# Altium schematic sheet [01] - COVER PAGE.SchDoc
size A3; DocumentNumber: 1; SheetNumber: 1; SheetTotal: 32
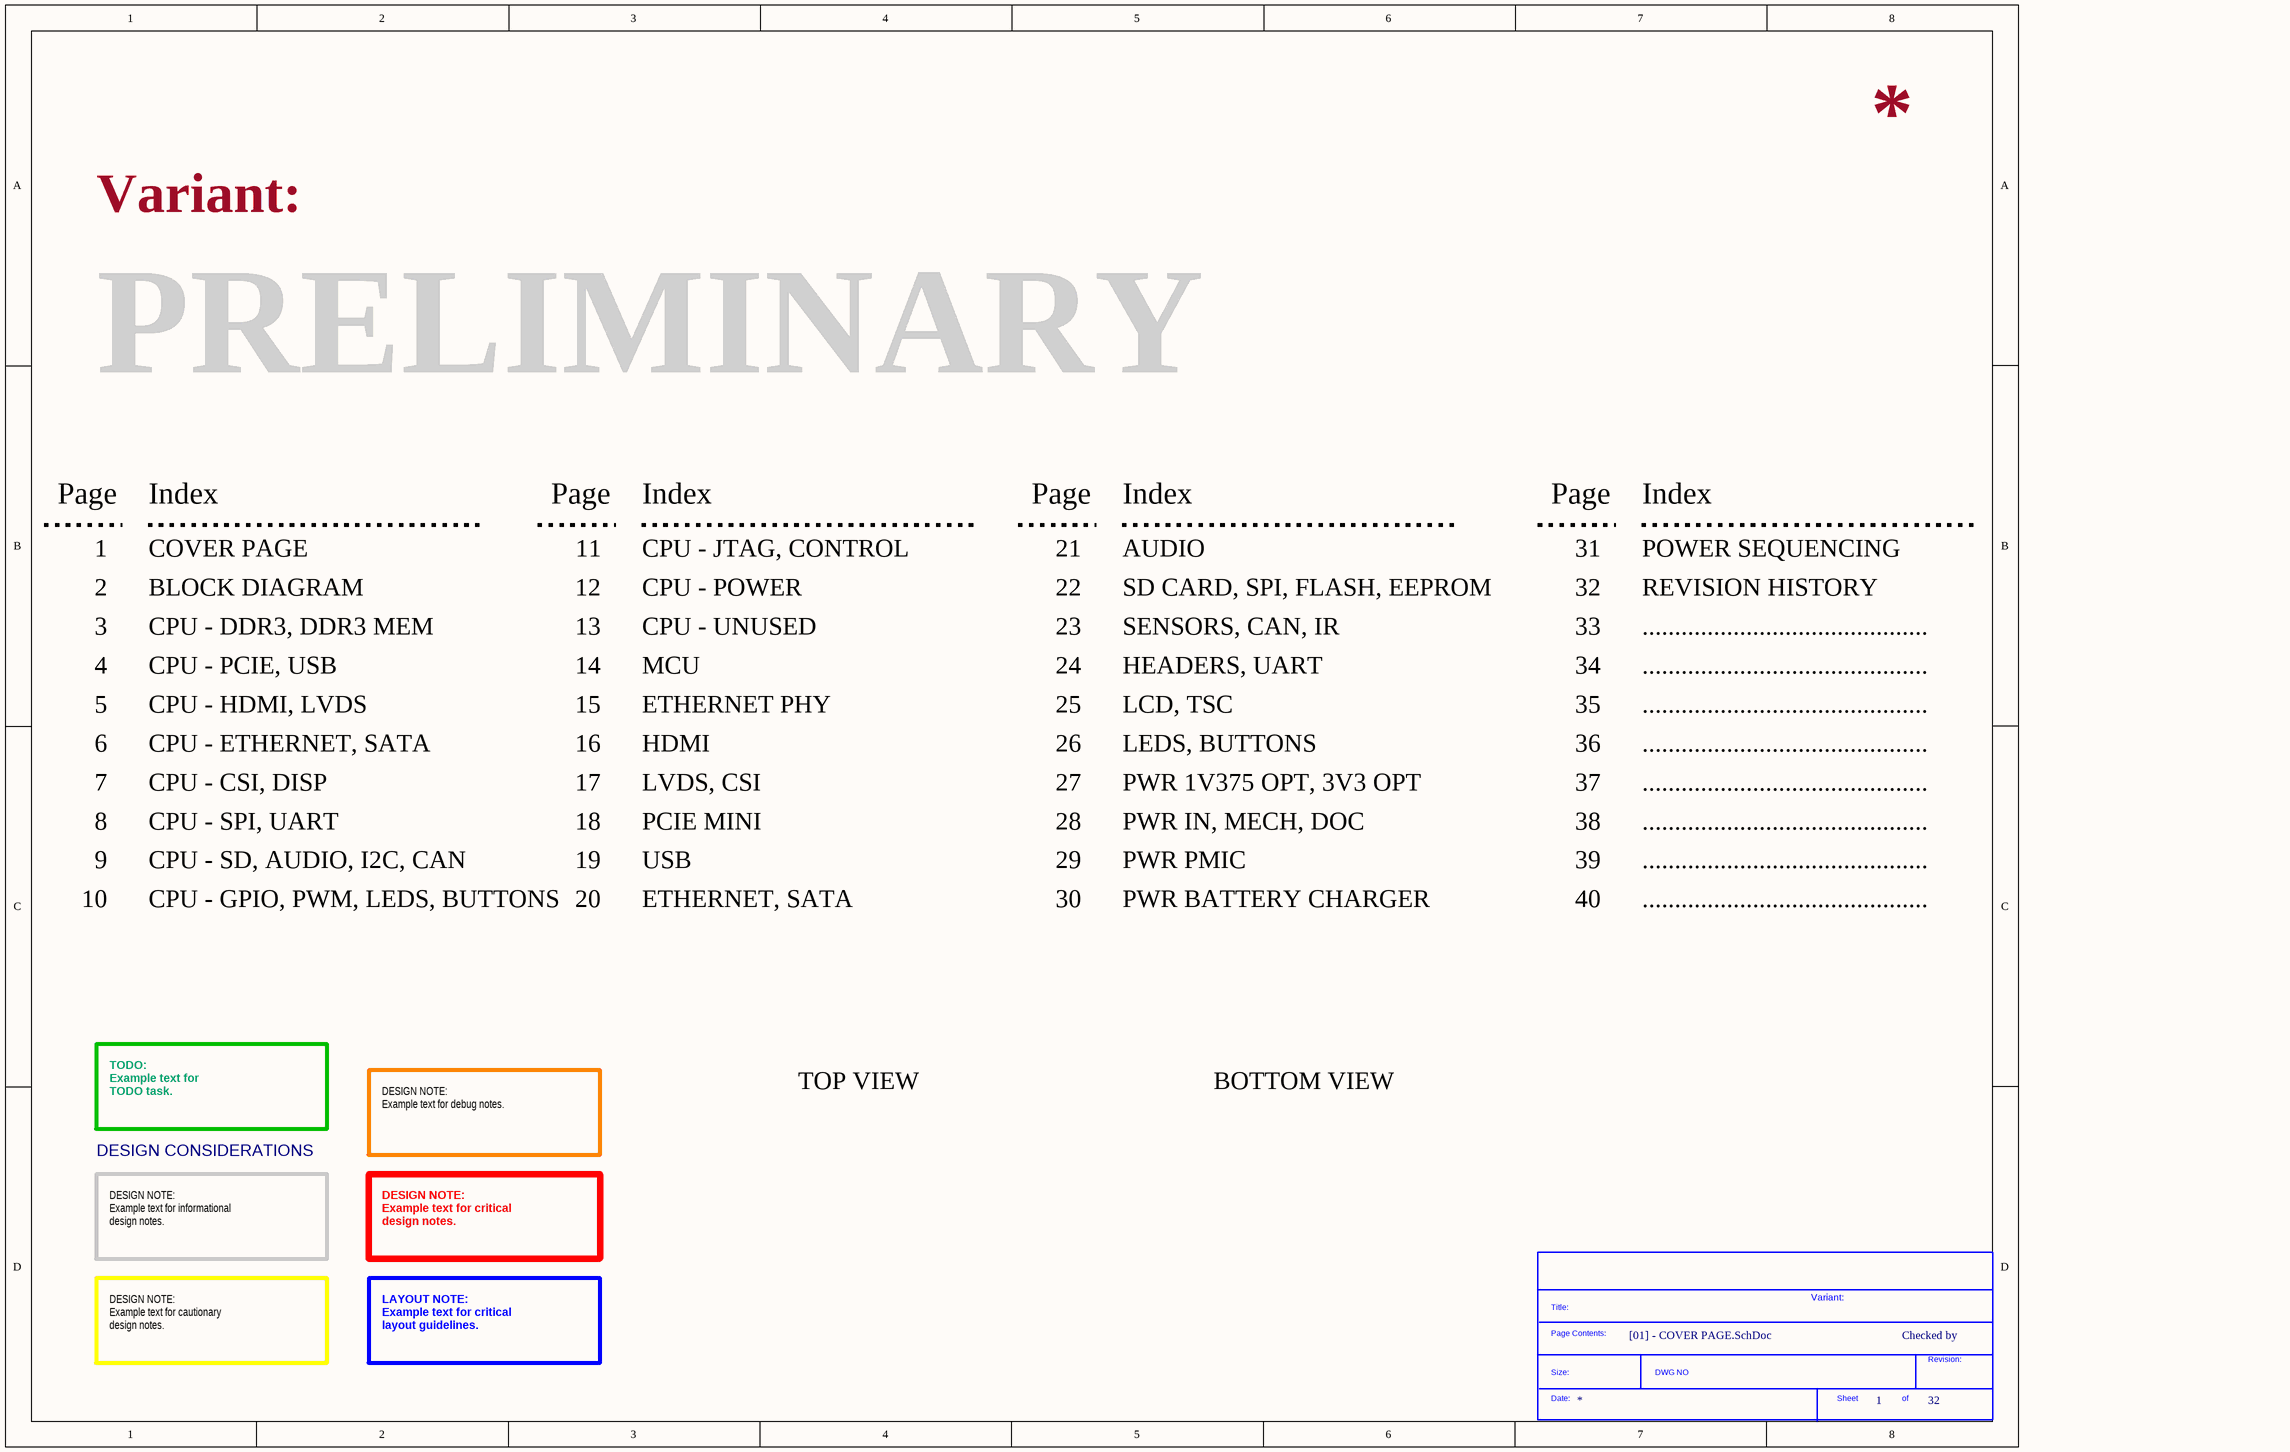
[diagram p0: [01] - COVER PAGE.SchDoc]

## Parts
*  SDTitleBlock  (value not drawn)  (graphical)

## Notes on the sheet
- Variant:
- PRELIMINARY
- Page
- 1
- Index
- COVER PAGE
- 11
- CPU - JTAG, CONTROL
- 21
- AUDIO
- 31
- POWER SEQUENCING
- 2
- BLOCK DIAGRAM
- 12
- CPU - POWER
- 22
- SD CARD, SPI, FLASH, EEPROM
- 32
- REVISION HISTORY
- 3
- 4
- CPU - DDR3, DDR3 MEM
- CPU - PCIE, USB
- 13
- 14
- CPU - UNUSED
- MCU
- 23
- 24
- SENSORS, CAN, IR
- HEADERS, UART
- 33
- 34
- ............................................
- 5
- 6
- CPU - HDMI, LVDS
- CPU - ETHERNET, SATA
- 15
- 16
- ETHERNET PHY
- HDMI
- 25
- 26
- LCD, TSC
- LEDS, BUTTONS
- 35
- 36
- 7
- CPU - CSI, DISP
- 17
- LVDS, CSI
- 27
- PWR 1V375 OPT, 3V3 OPT
- 37
- 8
- 9
- CPU - SPI, UART
- CPU - SD, AUDIO, I2C, CAN
- 18
- 19
- PCIE MINI
- USB
- 28
- 29
- PWR IN, MECH, DOC
- PWR PMIC
- 38
- 39
- 10
- CPU - GPIO, PWM, LEDS, BUTTONS
- 20
- ETHERNET, SATA
- 30
- PWR BATTERY CHARGER
- 40
- TODO:
  Example text for
  TODO task.
- DESIGN NOTE:
  Example text for debug notes.
- TOP VIEW
- BOTTOM VIEW
- DESIGN CONSIDERATIONS
- DESIGN NOTE:
  Example text for informational
  design notes.
- DESIGN NOTE:
  Example text for critical
  design notes.
- Checked by
- DESIGN NOTE:
  Example text for cautionary
  design notes.
- LAYOUT NOTE:
  Example text for critical
  layout guidelines.
- (in symbol SDTitleBlock) Title:; Page Contents:; Revision:; Size:; DWG NO; Date:; Sheet; of